# EAGLE schematic AK4493-v1.64_10 (EAGLE 9.6.2)
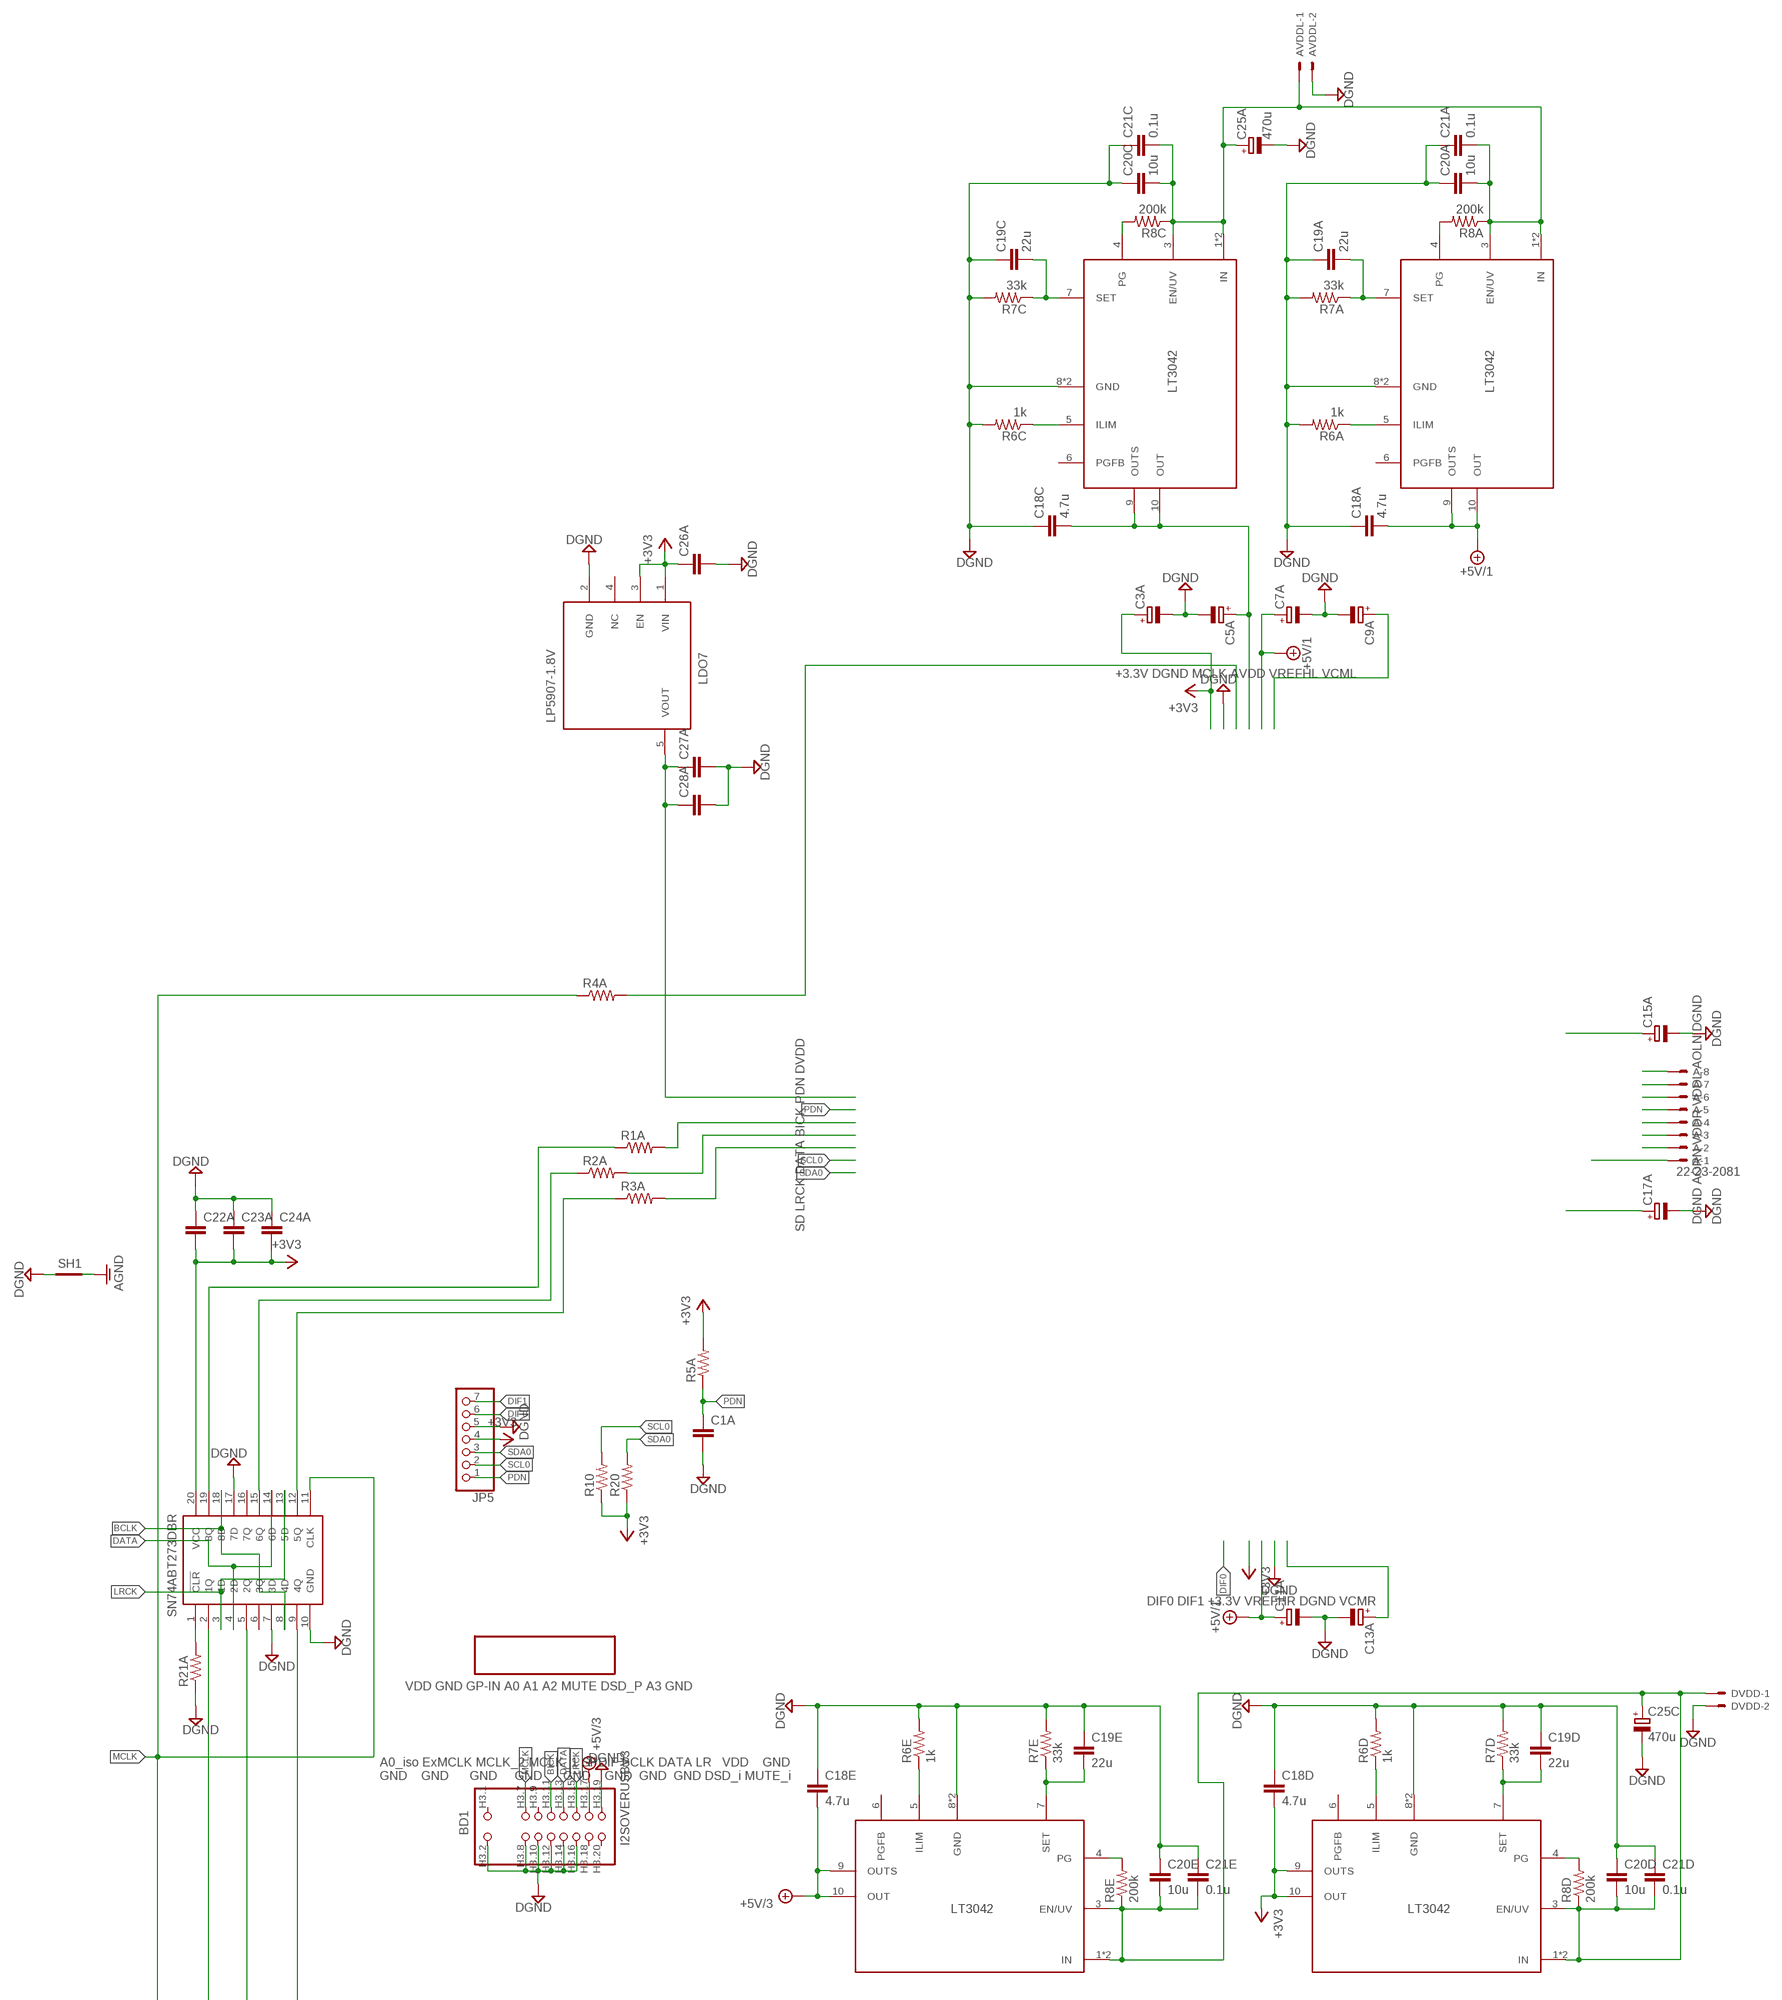
[diagram p0: schematic, sheet 1, part 1 of 2]
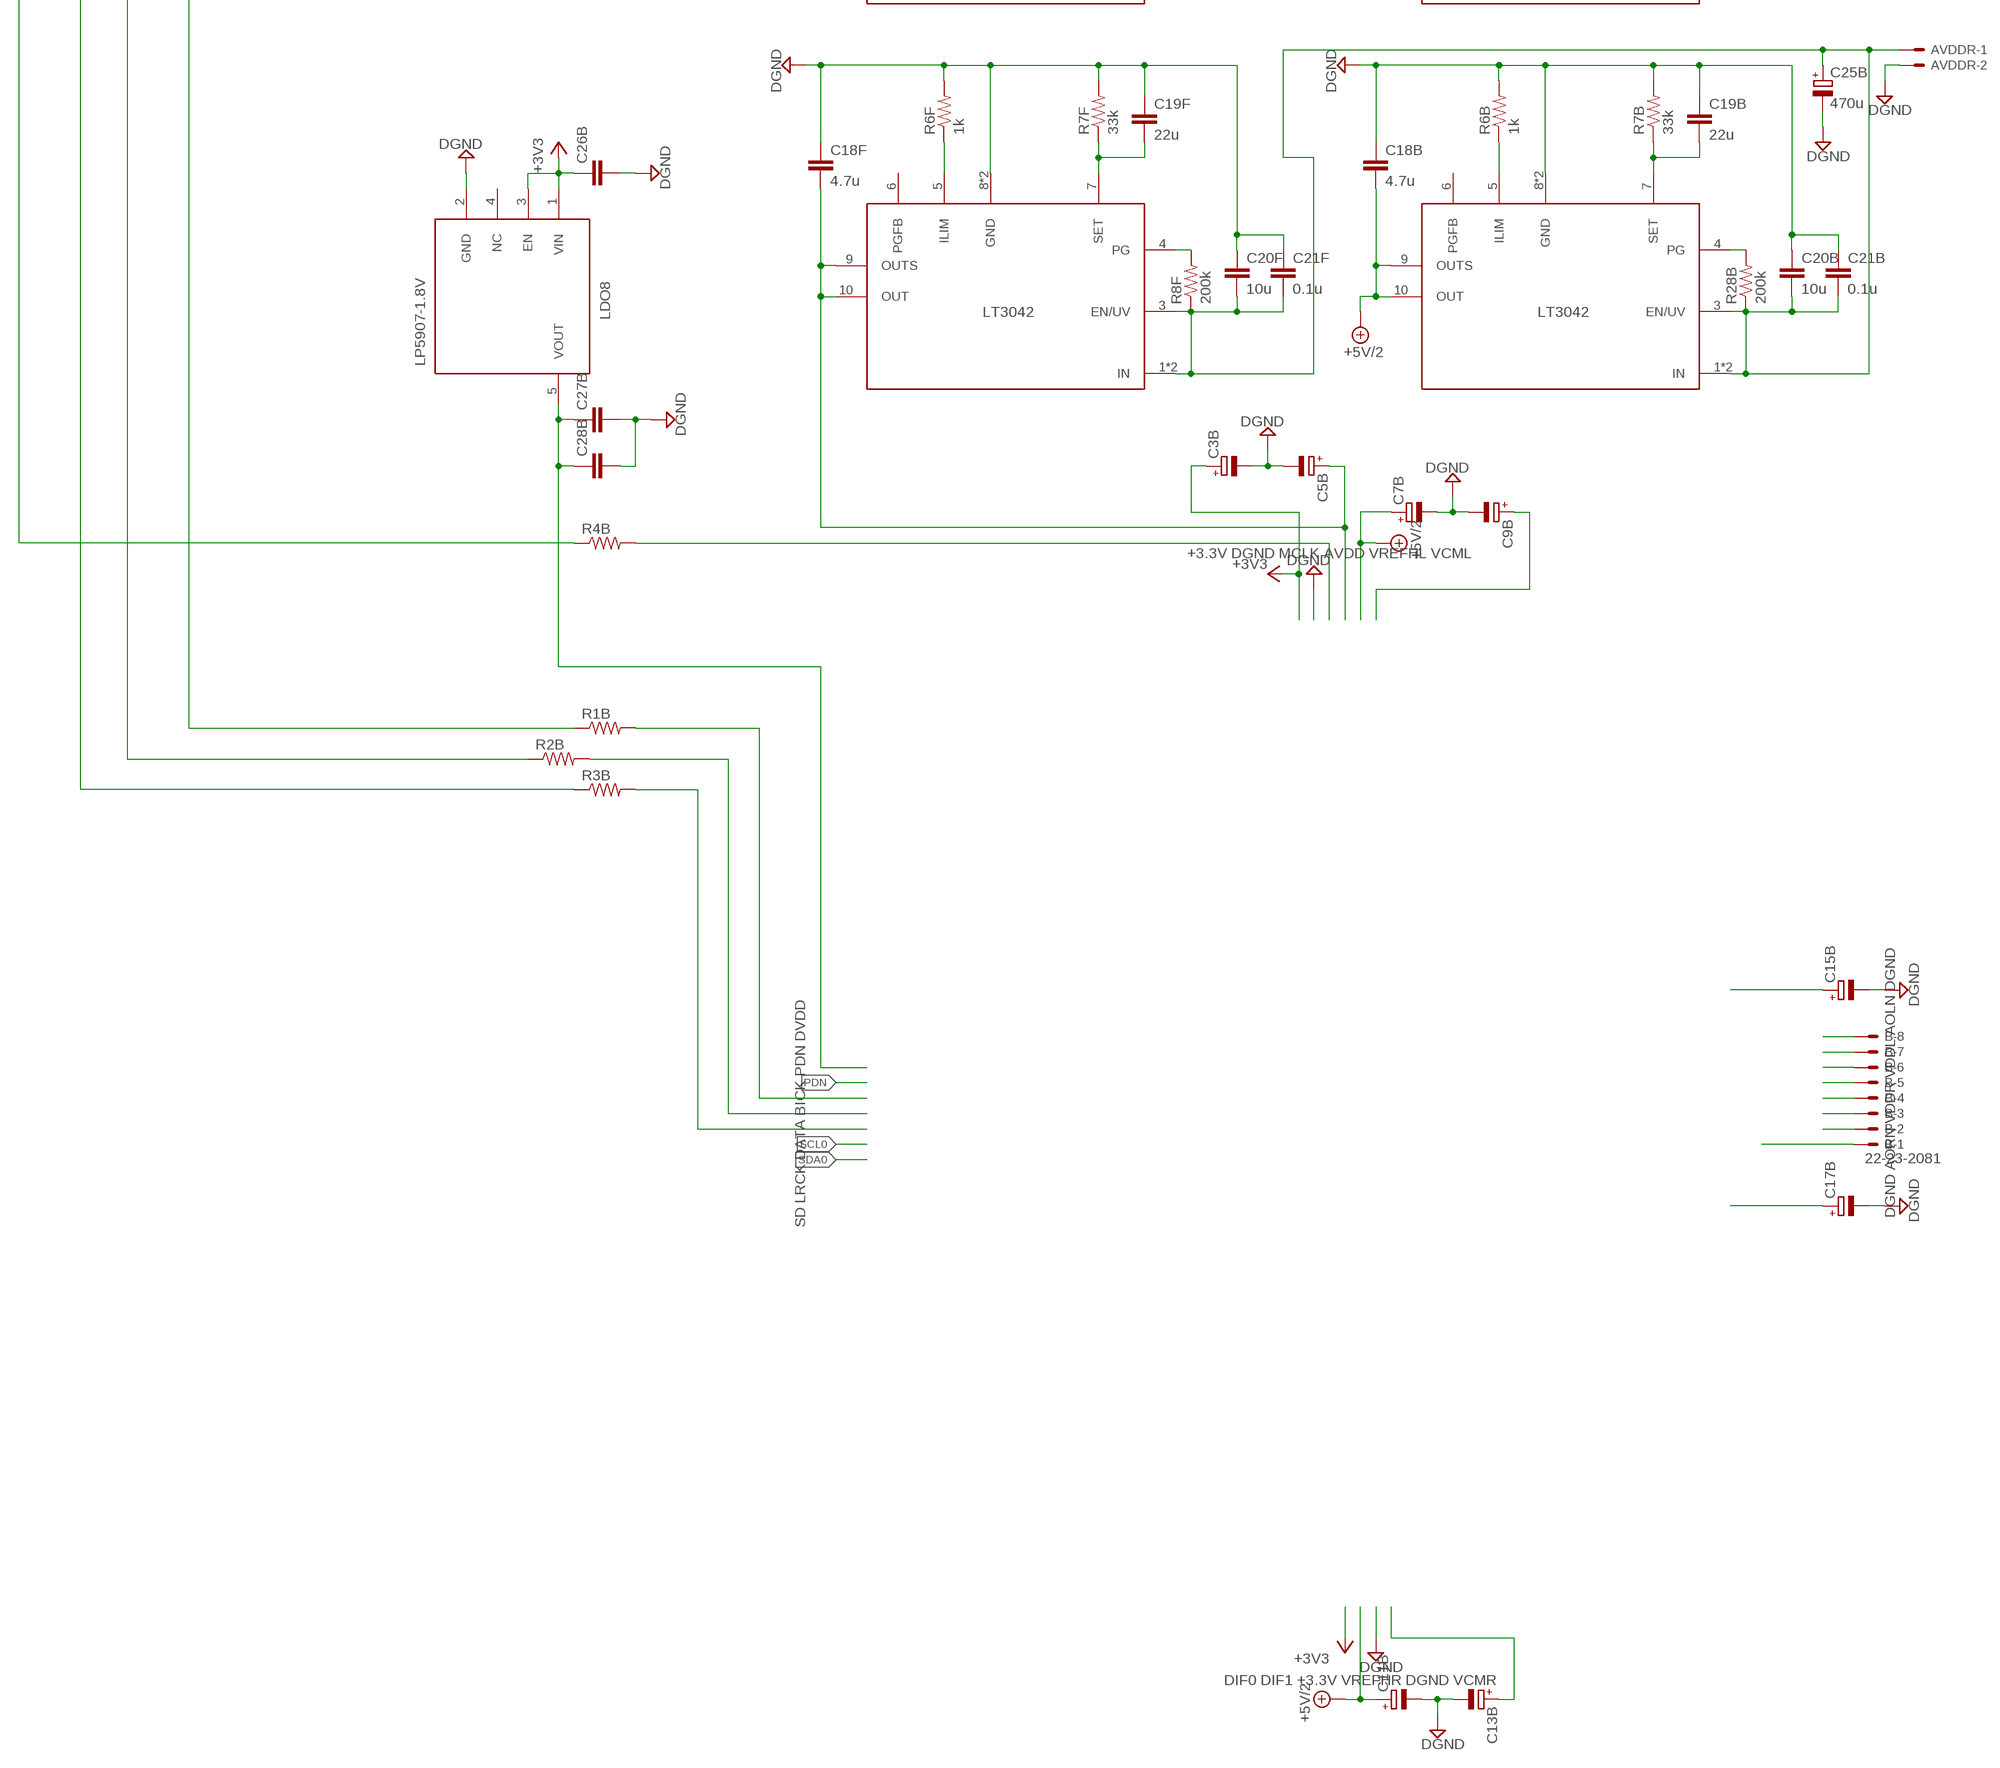
[diagram p1: schematic, sheet 1, part 2 of 2]

## Parts
A  22-23-2081  [22-23-2081]
AVDDL  22-23-2021  [22-23-2021]
AVDDR  22-23-2021  [22-23-2021]
B  22-23-2081  [22-23-2081]
BD1  I2SOVERUSBV3  [I2SOVERUSBV3]
C1A  C-EUC0805K  [C0805K]
C3A  CPOL-EUE2.5-5  [E2,5-5]
C3B  CPOL-EUE2.5-5  [E2,5-5]
C5A  CPOL-EUE2.5-5  [E2,5-5]
C5B  CPOL-EUE2.5-5  [E2,5-5]
C7A  CPOL-EUE5-8.5  [E5-8,5]
C7B  CPOL-EUE5-8.5  [E5-8,5]
C9A  CPOL-EUE2-4  [E2-4]
C9B  CPOL-EUE2-4  [E2-4]
C11A  CPOL-EUE5-8.5  [E5-8,5]
C11B  CPOL-EUE5-8.5  [E5-8,5]
C13A  CPOL-EUE2-4  [E2-4]
C13B  CPOL-EUE2-4  [E2-4]
C15A  CPOL-EUE2-4  [E2-4]
C15B  CPOL-EUE2-4  [E2-4]
C17A  CPOL-EUE2-4  [E2-4]
C17B  CPOL-EUE2-4  [E2-4]
C18A  4.7u  C-EUC0805K  [C0805K]
C18B  4.7u  C-EUC0805K  [C0805K]
C18C  4.7u  C-EUC0805K  [C0805K]
C18D  4.7u  C-EUC0805K  [C0805K]
C18E  4.7u  C-EUC0805K  [C0805K]
C18F  4.7u  C-EUC0805K  [C0805K]
C19A  22u  C-EUC1206K  [C1206K]
C19B  22u  C-EUC1206K  [C1206K]
C19C  22u  C-EUC1206K  [C1206K]
C19D  22u  C-EUC1206K  [C1206K]
C19E  22u  C-EUC1206K  [C1206K]
C19F  22u  C-EUC1206K  [C1206K]
C20A  10u  C-EUC0805K  [C0805K]
C20B  10u  C-EUC0805K  [C0805K]
C20C  10u  C-EUC0805K  [C0805K]
C20D  10u  C-EUC0805K  [C0805K]
C20E  10u  C-EUC0805K  [C0805K]
C20F  10u  C-EUC0805K  [C0805K]
C21A  0.1u  C-EUC0805K  [C0805K]
C21B  0.1u  C-EUC0805K  [C0805K]
C21C  0.1u  C-EUC0805K  [C0805K]
C21D  0.1u  C-EUC0805K  [C0805K]
C21E  0.1u  C-EUC0805K  [C0805K]
C21F  0.1u  C-EUC0805K  [C0805K]
C22A  C-EUC0603K  [C0603K]
C23A  C-EUC0603K  [C0603K]
C24A  C-EUC0603K  [C0603K]
C25A  470u  CPOL-EUE2.5-7  [E2,5-7]
C25B  470u  CPOL-EUE2.5-7  [E2,5-7]
C25C  470u  CPOL-EUE2.5-7  [E2,5-7]
C26A  C-EUC0805K  [C0805K]
C26B  C-EUC0805K  [C0805K]
C27A  C-EUC0805K  [C0805K]
C27B  C-EUC0805K  [C0805K]
C28A  C-EUC0603K  [C0603K]
C28B  C-EUC0603K  [C0603K]
DVDD  22-23-2021  [22-23-2021]
IC4A  SN74ABT273DBR  [SOP65P780X200-20N]
JP5  PINHD-1X7  [1X07]
LDO1  LT3042  [SOP50P490X110-11N]
LDO2  LT3042  [SOP50P490X110-11N]
LDO3  LT3042  [SOP50P490X110-11N]
LDO4  LT3042  [SOP50P490X110-11N]
LDO5  LT3042  [SOP50P490X110-11N]
LDO7  LP5907-1.8V  [SOT95P280X145-5N]
LDO8  LP5907-1.8V  [SOT95P280X145-5N]
LDO9  LT3042  [SOP50P490X110-11N]
R1A  R-US_R0603  [R0603]
R1B  R-US_R0603  [R0603]
R2A  R-US_R0603  [R0603]
R2B  R-US_R0603  [R0603]
R3A  R-US_R0603  [R0603]
R3B  R-US_R0603  [R0603]
R4A  R-US_R0603  [R0603]
R4B  R-US_R0603  [R0603]
R5A  R-US_R0805  [R0805]
R6A  1k  R-US_R0805  [R0805]
R6B  1k  R-US_R0805  [R0805]
R6C  1k  R-US_R0805  [R0805]
R6D  1k  R-US_R0805  [R0805]
R6E  1k  R-US_R0805  [R0805]
R6F  1k  R-US_R0805  [R0805]
R7A  33k  R-US_R0805  [R0805]
R7B  33k  R-US_R0805  [R0805]
R7C  33k  R-US_R0805  [R0805]
R7D  33k  R-US_R0805  [R0805]
R7E  33k  R-US_R0805  [R0805]
R7F  33k  R-US_R0805  [R0805]
R8A  200k  R-US_R0805  [R0805]
R8C  200k  R-US_R0805  [R0805]
R8D  200k  R-US_R0805  [R0805]
R8E  200k  R-US_R0805  [R0805]
R8F  200k  R-US_R0805  [R0805]
R10  R-US_R0805  [R0805]
R20  R-US_R0805  [R0805]
R21A  R-US_R0805  [R0805]
R28B  200k  R-US_R0805  [R0805]
SH1  SHORTA5  [SHORT_ALL-50]

## Nets
+3V3: C3A.+ C3B.+ C18D.2 C22A.2 C23A.2 C24A.2 C26A.1 C26B.1 IC4A.20(VCC) JP5.4 LDO1.9(OUTS) LDO1.10(OUT) LDO7.1(VIN) LDO7.3(EN) LDO8.1(VIN) LDO8.3(EN) R5A.2 R10.1 R20.1
+5V/1: C7A.+ C11A.+ C18A.2 LDO3.9(OUTS) LDO3.10(OUT)
+5V/2: C7B.+ C11B.+ C18B.2 LDO9.9(OUTS) LDO9.10(OUT)
+5V/3: BD1.H3.17 C18E.2 LDO2.9(OUTS) LDO2.10(OUT)
AGND: SH1.2
BCLK: IC4A.8(4D) IC4A.18(8D)
BICK: BD1.H3.11
DATA: BD1.H3.13 IC4A.4(2D) IC4A.14(6D)
DGND: AVDDL.2 AVDDR.2 BD1.H3.2 BD1.H3.8 BD1.H3.10 BD1.H3.12 BD1.H3.14 BD1.H3.16 BD1.H3.19 C1A.2 C3A.- C3B.- C5A.- C5B.- C7A.- C7B.- C9A.- C9B.- C11A.- C11B.- C13A.- C13B.- C15A.- C15B.- C17A.- C17B.- C18A.1 C18B.1 C18C.1 C18D.1 C18E.1 C18F.1 C19A.1 C19B.1 C19C.1 C19D.1 C19E.1 C19F.1 C20A.1 C20B.1 C20C.1 C20D.1 C20E.1 C20F.1 C21A.1 C21B.1 C21C.1 C21D.1 C21E.1 C21F.1 C22A.1 C23A.1 C24A.1 C25A.- C25B.- C25C.- C26A.2 C26B.2 C27A.2 C27B.2 C28A.2 C28B.2 DVDD.2 IC4A.7(3D) IC4A.10(GND) IC4A.17(7D) JP5.5 LDO1.8(GND) LDO1.11(GND) LDO2.8(GND) LDO2.11(GND) LDO3.8(GND) LDO3.11(GND) LDO4.8(GND) LDO4.11(GND) LDO5.8(GND) LDO5.11(GND) LDO7.2(GND) LDO8.2(GND) LDO9.8(GND) LDO9.11(GND) R6A.2 R6B.2 R6C.2 R6D.2 R6E.2 R6F.2 R7A.2 R7B.2 R7C.2 R7D.2 R7E.2 R7F.2 R21A.1 SH1.1
DIF0: JP5.6
DIF1: JP5.7
LRCK: BD1.H3.15 IC4A.3(1D) IC4A.13(5D)
MCLK: BD1.H3.7 IC4A.11(CLK) R4A.1 R4B.1
N$1: IC4A.1(!CLR) R21A.2
N$5: LDO5.5(ILIM) R6C.1
N$6: LDO1.5(ILIM) R6D.1
N$7: C19D.2 LDO1.7(SET) R7D.1
N$8: LDO1.4(PG) R8D.2
N$9: LDO2.5(ILIM) R6E.1
N$10: C19E.2 LDO2.7(SET) R7E.1
N$11: R4B.2
N$13: LDO2.4(PG) R8E.2
N$14: C20D.2 C20E.2 C21D.2 C21E.2 C25C.+ DVDD.1 LDO1.1(IN) LDO1.2(IN) LDO1.3(EN/UV) LDO2.1(IN) LDO2.2(IN) LDO2.3(EN/UV) R8D.1 R8E.1
N$15: LDO3.5(ILIM) R6A.1
N$17: B.5
N$18: B.4
N$19: R3A.2
N$20: R2A.2
N$21: R1A.2
N$22: C19A.2 LDO3.7(SET) R7A.1
N$23: IC4A.19(8Q) R1A.1
N$24: IC4A.15(6Q) R2A.1
N$25: IC4A.12(5Q) R3A.1
N$27: R1B.2
N$28: R2B.2
N$29: R3B.2
N$30: IC4A.9(4Q) R1B.1
N$31: IC4A.5(2Q) R2B.1
N$32: IC4A.2(1Q) R3B.1
N$33: LDO3.4(PG) R8A.2
N$35: LDO4.5(ILIM) R6F.1
N$36: C19F.2 LDO4.7(SET) R7F.1
N$37: C27A.1 C28A.1 LDO7.5(VOUT)
N$39: LDO4.4(PG) R8F.2
N$40: AVDDL.1 C20A.2 C20C.2 C21A.2 C21C.2 C25A.+ LDO3.1(IN) LDO3.2(IN) LDO3.3(EN/UV) LDO5.1(IN) LDO5.2(IN) LDO5.3(EN/UV) R8A.1 R8C.1
N$42: C5B.+ C18F.2 LDO4.9(OUTS) LDO4.10(OUT)
N$43: C19C.2 LDO5.7(SET) R7C.1
N$44: LDO5.4(PG) R8C.2
N$46: C5A.+ C18C.2 LDO5.9(OUTS) LDO5.10(OUT)
N$48: LDO9.5(ILIM) R6B.1
N$49: C19B.2 LDO9.7(SET) R7B.1
N$50: LDO9.4(PG) R28B.2
N$51: AVDDR.1 C20B.2 C20F.2 C21B.2 C21F.2 C25B.+ LDO4.1(IN) LDO4.2(IN) LDO4.3(EN/UV) LDO9.1(IN) LDO9.2(IN) LDO9.3(EN/UV) R8F.1 R28B.1
N$56: C9A.+
N$57: A.8
N$58: A.7
N$59: A.6
N$60: A.5
N$61: A.4
N$62: A.3
N$63: A.2
N$66: C27B.1 C28B.1 LDO8.5(VOUT)
N$69: C13A.+
N$74: C9B.+
N$76: C15B.+
N$78: C17B.+
N$79: B.8
N$80: B.1
N$84: B.7
N$87: B.6
N$88: B.3
N$89: B.2
N$90: A.1
N$99: R4A.2
N$101: C13B.+
N$117: C15A.+
N$118: C17A.+
PDN: C1A.1 JP5.1 R5A.1
SCL0: JP5.2 R10.2
SDA0: JP5.3 R20.2
Unconnected: BD1.H3.1 BD1.H3.9 BD1.H3.18 BD1.H3.20 IC4A.6(3Q) IC4A.16(7Q) LDO1.6(PGFB) LDO2.6(PGFB) LDO3.6(PGFB) LDO4.6(PGFB) LDO5.6(PGFB) LDO7.4(NC) LDO8.4(NC) LDO9.6(PGFB)

## Notes on the sheet
- +3.3V DGND MCLK AVDD VREFHL VCML
- DGND AORN VDDR VDDL AOLN DGND
- SD LRCK DATA BICK PDN DVDD
- DIF0 DIF1 +3.3V VREFHR DGND VCMR
- +3.3V DGND MCLK AVDD VREFHL VCML
- DGND AORN VDDR VDDL AOLN DGND
- SD LRCK DATA BICK PDN DVDD
- DIF0 DIF1 +3.3V VREFHR DGND VCMR

## Library data of the parts
A B = con-molex:22-23-2081: .100" (2.54mm) Center Header - 8 Pin; MF: MOLEX; MPN: 22-23-2081; OC_FARNELL: 1756826; OC_NEWARK: 01C7592
AVDDL AVDDR DVDD = con-molex:22-23-2021: .100" (2.54mm) Center Header - 2 Pin; MF: MOLEX; MPN: 22-23-2021; OC_FARNELL: 1462926; OC_NEWARK: 25C3832
BD1 = Hifi Nutube DAC (Next 6) 28:I2SOVERUSBV3: Asynchronous audio transfer at sampling rates up to 768 kHz and 32 bit; BOM: Yes; DESCRIPTION: Asynchronous audio transfer at sampling rates up to 768 kHz and 32 bit
C1A C18A C18B C18C C18D C18E C18F C19A C19B C19C C19D C19E C19F C20A C20B C20C C20D C20E C20F C21A C21B C21C C21D C21E C21F C22A C23A C24A C26A C26B C27A C27B C28A C28B = rcl:C-EU: CAPACITOR, European symbol; SPICEPREFIX: C
C3A C3B C5A C5B C7A C7B C9A C9B C11A C11B C13A C13B C15A C15B C17A C17B C25A C25B C25C = rcl:CPOL-EU: POLARIZED CAPACITOR, European symbol; SPICEPREFIX: C
IC4A = SN74ABT273DBR:SN74ABT273DBR: Octal Edge-Triggered D-Type Flip-Flops With Clear Source: Datasheet <http://www.ti.com/lit/gpn/sn74abt273>; DESCRIPTION: Octal Edge-Triggered D-Type Flip-Flops With Clear; HEIGHT: 2mm; MANUFACTURER_NAME: Texas Instruments; MANUFACTURER_PART_NUMBER: SN74ABT273DBR; MOUSER_PART_NUMBER: 595-SN74ABT273DBR; MOUSER_PRICE-STOCK: https://www.mouser.co.uk/ProductDetail/Texas-Instruments/SN74ABT273DBR?qs=X1HXWTtiZ0RWq%2Fv0JNOEpw%3D%3D
JP5 = pinhead:PINHD-1X7: PIN HEADER
LDO1-LDO5 LDO9 = LT3042EMSE#PBF:LT3042: LINEAR TECHNOLOGY - LT3042EMSE#PBF - LDO, ADJ, 0.2A, 0V-15V, MSOP-10 Source: Datasheet <http://www.linear.com/docs/46159>; DESCRIPTION: LINEAR TECHNOLOGY - LT3042EMSE#PBF - LDO, ADJ, 0.2A, 0V-15V, MSOP-10; HEIGHT: 1.1mm; MANUFACTURER_NAME: Linear Technology; MANUFACTURER_PART_NUMBER: LT3042EMSE#PBF; MOUSER_PART_NUMBER: 584-LT3042EMSE#PBF; MOUSER_PRICE-STOCK: https://www.mouser.co.uk/ProductDetail/Analog-Devices-Linear-Technology/LT3042EMSEPBF?qs=oahfZPh6IAJ3XP16d20ITw%3D%3D
LDO7 LDO8 = LP5907-1.8V:LP5907-1.8V: 250-mA ultra-low-noise low-IQ low-dropout (LDO) linear regulator Source: Datasheet <http://www.ti.com/lit/gpn/lp5907>; ARROW_PART_NUMBER: LP5907MFX-1.8/NOPB; ARROW_PRICE-STOCK: https://www.arrow.com/en/products/lp5907mfx-1.8nopb/texas-instruments?region=nac; DESCRIPTION: 250-mA ultra-low-noise low-IQ low-dropout (LDO) linear regulator; HEIGHT: 1.45mm; MANUFACTURER_NAME: Texas Instruments; MANUFACTURER_PART_NUMBER: LP5907MFX-1.8/NOPB; MOUSER_PART_NUMBER: 595-LP5907MFX-1.8NPB; MOUSER_PRICE-STOCK: https://www.mouser.co.uk/ProductDetail/Texas-Instruments/LP5907MFX-1.8-NOPB?qs=biyDIajrTn5jh5ArkSZeqw%3D%3D
R1A R1B R2A R2B R3A R3B R4A R4B R5A R6A R6B R6C R6D R6E R6F R7A R7B R7C R7D R7E R7F R8A R8C R8D R8E R8F R10 R20 R21A R28B = rcl:R-US_: RESISTOR, American symbol; SPICEPREFIX: R
SH1 = Hifi Nutube DAC (Next 6) 28:SHORT: Short between two nets; BOM: No; DESCRIPTION: Short between two nets

## Net classes
3 Power: width 1.27 mm, drill 1.27 mm, clearance 0.254 mm